# EAGLE design Micro Power Distribution (EAGLE 6.5.0)
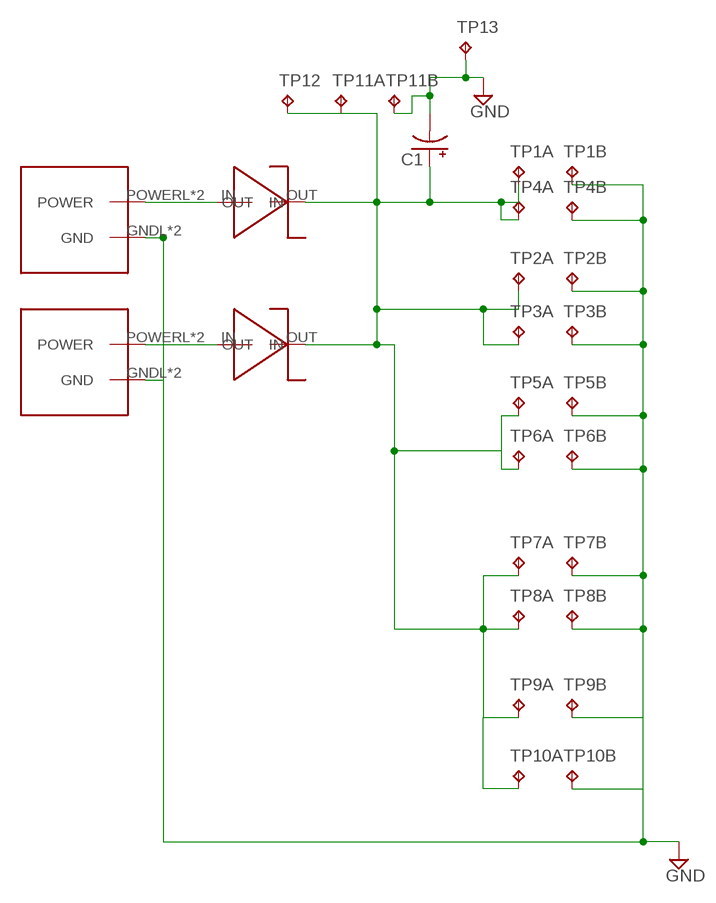
[diagram p0: schematic, sheet 1]

## Parts
C1  CPOL-USE2.5-6  [E2,5-6]
TP1  TP2P2-38-17  [P2-38-17]
TP2  TP2P2-38-17  [P2-38-17]
TP3  TP2P2-38-17  [P2-38-17]
TP4  TP2P2-38-17  [P2-38-17]
TP5  TP2P2-38-17  [P2-38-17]
TP6  TP2P2-38-17  [P2-38-17]
TP7  TP2P2-38-17  [P2-38-17]
TP8  TP2P2-38-17  [P2-38-17]
TP9  TP2P2-38-17  [P2-38-17]
TP10  TP2P2-38-17  [P2-38-17]
TP11  TP2P2-38-17  [P2-38-17]
TP12  TPTP20SQ  [TP20SQ]
TP13  TPTP20SQ  [TP20SQ]
U$1  2X2-MOLEX  [2X2MOLEX]
U$5  2X2-MOLEX  [2X2MOLEX]
U$6  DO-214AB  [DO-214AB]
U$7  DO-214AB  [DO-214AB]

## Nets
GND: C1.- TP1.TP-2 TP2.TP-2 TP3.TP-2 TP4.TP-2 TP5.TP-2 TP6.TP-2 TP7.TP-2 TP8.TP-2 TP9.TP-2 TP10.TP-2 TP11.TP-2 TP13.TP U$1.GNDL(GND) U$1.GNDR(GND) U$5.GNDL(GND) U$5.GNDR(GND)
N$1: U$5.POWERL(POWER) U$5.POWERR(POWER) U$6.IN
N$2: U$1.POWERL(POWER) U$1.POWERR(POWER) U$7.IN
N$10: C1.+ TP1.TP-1 TP2.TP-1 TP3.TP-1 TP4.TP-1 TP5.TP-1 TP6.TP-1 TP7.TP-1 TP8.TP-1 TP9.TP-1 TP10.TP-1 TP11.TP-1 TP12.TP U$6.OUT U$7.OUT

## Library data of the parts
C1 = resistor:CPOL-US: POLARIZED CAPACITOR, American symbol
TP1-TP11 = testpad:TP2: Test pad
TP12 TP13 = testpad:TP: Test pad
U$1 U$5 = Molex:2X2-MOLEX
U$6 U$7 = Diodes:DO-214AB

## Board
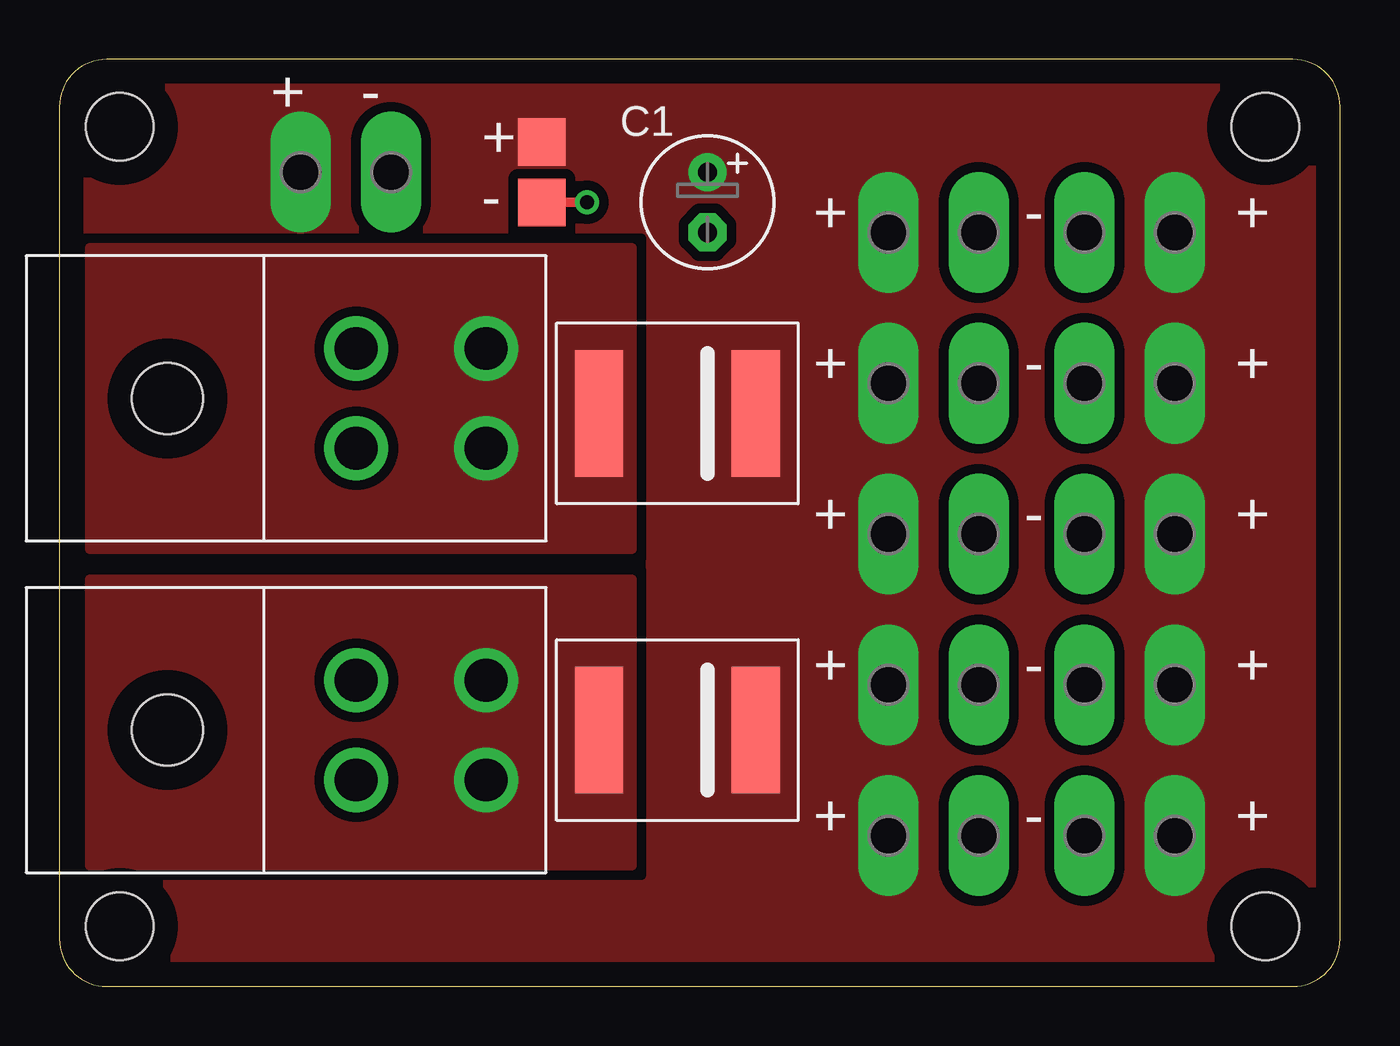
[diagram p1: board, top side]
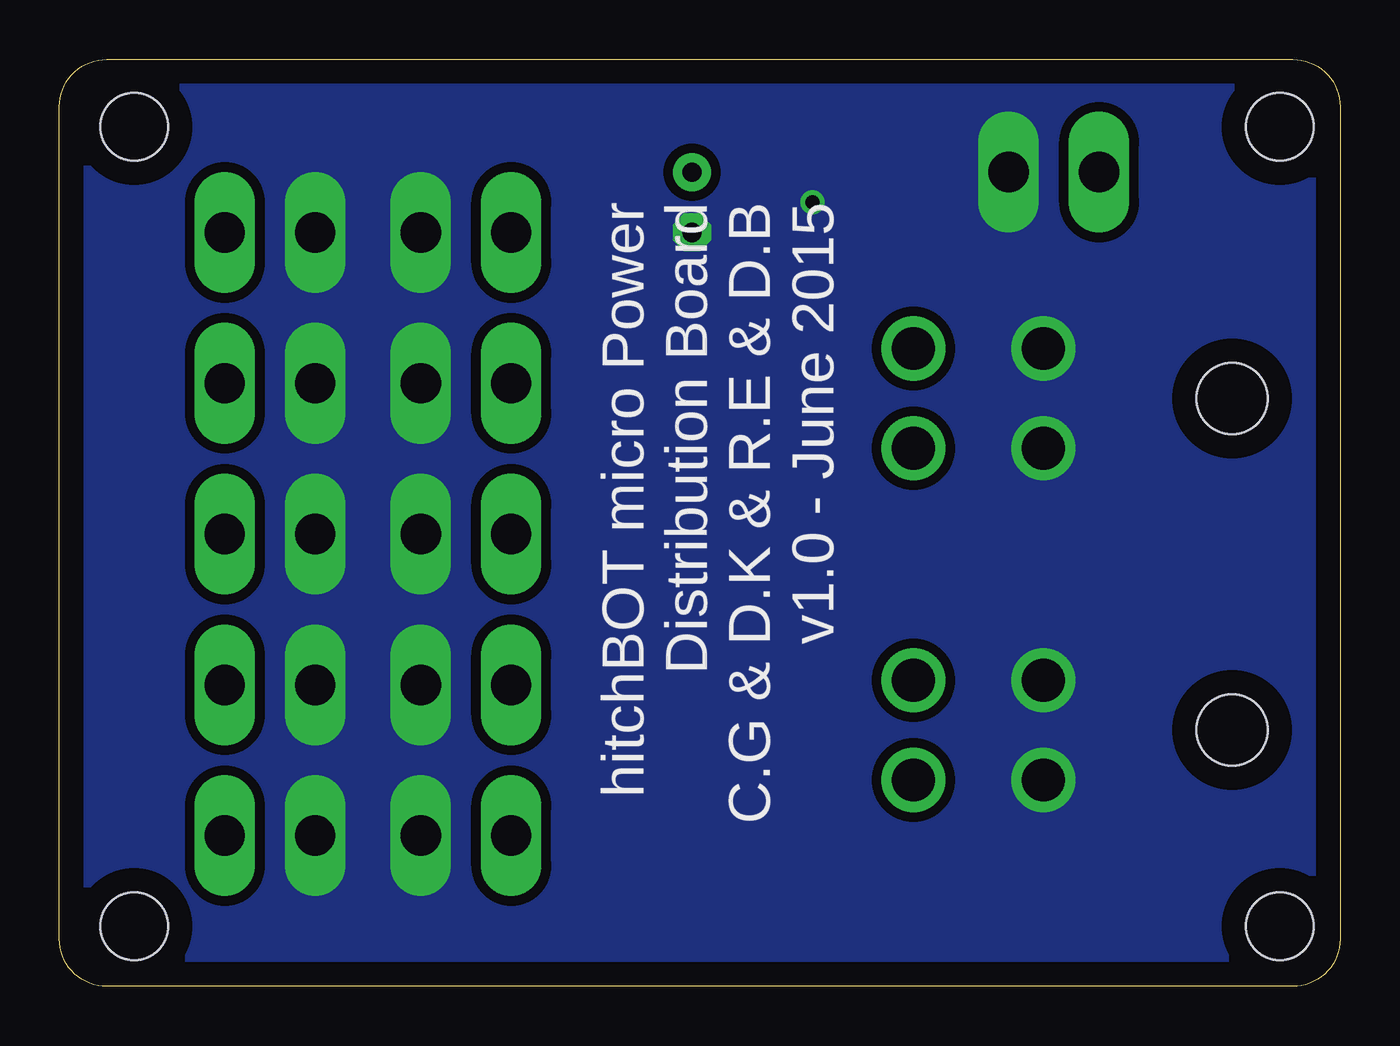
[diagram p2: board, bottom side, seen from below]

Size 53.95 x 39.04 mm. Coordinates in mm from the lower left corner, seen from the top.
Outline: 53.95,2 53.95,37.04 arc90 51.95,39.04 2,39.04 arc90 0,37.04 0,2 arc90 2,0 51.95,0 arc90 53.95,2
Copper layers (1*16): Top 0.035mm / dielectric 1.5mm / Bottom 0.035mm
Design rules "default": minimum track width 10mil, minimum drill 24mil, track to track 8mil, track to pad 8mil, pad to pad 8mil, via to via 8mil, smd to smd 8mil, copper to edge 40mil, drill to drill 8mil, minimum pad ring 10mil, minimum via ring 8mil, stop-mask expansion 4mil, vias tented up to drill 0mil, thermal gap 10mil
Holes 2.84 mm at 2.54,36.2 50.8,36.2 50.8,2.54 2.54,2.54

### Footprints (pad centres in the part's own frame; a part is rotated, then mirrored left to right if it is on the bottom)
E2,5-6 = drill 0.813 pad 1.6: + -1.27,0 | drill 0.813 pad 1.6 octagon: - 1.27,0
P2-38-17 = drill 1.702 pad 2.121 long: TP-1 -1.905,0; TP-2 1.905,0
TP20SQ = smd 2 x 2: TP 0,0
2X2MOLEX = drill 1.8: GNDL -2.1,-2.1; GNDR 2.1,-2.1; POWERL -2.1,3.37; POWERR 2.1,3.37 | hole 3: 0,-10.05
DO-214AB = smd 2.032 x 5.334: IN -3.302,0; OUT 3.302,0

### Placement (x,y rotation side)
C1  27.3,33.02 270 top
TP1  36.83,6.35 0 top
TP2  36.83,12.7 0 top
TP3  36.83,19.05 0 top
TP4  45.09,19.05 180 top
TP5  45.09,12.7 180 top
TP6  45.09,6.35 180 top
TP7  36.83,25.4 0 top
TP8  45.09,31.75 180 top
TP9  36.83,31.75 0 top
TP10  45.09,25.4 180 top
TP11  12.06,34.29 0 top
TP12  20.32,35.56 0 top
TP13  20.32,33.02 0 top
U$1  14.61,24.77 270 top
U$5  14.61,10.79 270 top
U$6  26.04,10.79 0 top
U$7  26.04,24.13 0 top

### Tracks (layer width: path | path; a pad name or v marks a point on that pad's centre or on a via)
GND  (via drill 0.6)
  Top 0.406: TP13.TP v22.23,33.02
  pour Bottom (isolate 0.406, no thermals): -1.27,40.01 54.61,40.01 54.61,-1.27 -1.27,-1.27
N$1
  pour Top (isolate 0.406, no thermals): 1.27,17.14 24.13,17.14 24.13,5.08 1.27,5.08
N$2
  pour Top (isolate 0.406, no thermals): 1.27,31.11 24.13,31.11 24.13,18.41 1.27,18.41
N$10
  pour Top (isolate 0.406, rank 2, no thermals): -1.27,40.01 54.61,40.01 54.61,-1.27 -1.27,-1.27

### Text on the board
tPlace: + | - | + | - | + | - | + | + | - | + | + | + | - | + | + | - | + | + | - | +
bPlace: hitchBOT micro Power / Distribution Board / C.G & D.K & R.E & D.B / v1.0 - June 2015